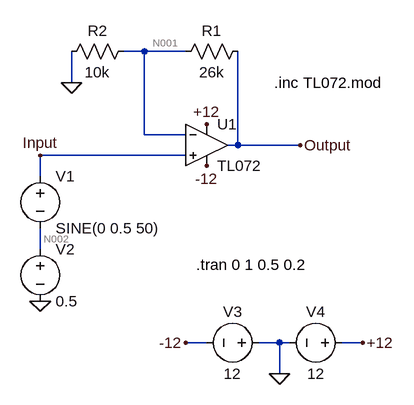
[diagram p0: schematic Noninverting Opamp.asc]
Noninverting Opamp.asc, the LTspice schematic file:
Version 4
SHEET 1 880 680
WIRE 256 0 224 0
WIRE 320 0 256 0
WIRE 144 48 144 0
WIRE 256 128 256 0
WIRE 320 128 256 128
WIRE 400 144 400 0
WIRE 400 144 384 144
WIRE 496 144 400 144
WIRE 320 160 96 160
WIRE 96 192 96 160
WIRE 96 304 96 272
WIRE 352 448 320 448
WIRE 464 448 432 448
WIRE 480 448 464 448
WIRE 592 448 560 448
WIRE 464 496 464 448
FLAG 96 384 0
FLAG 144 48 0
FLAG 496 144 Output
FLAG 96 160 Input
FLAG 464 496 0
FLAG 320 448 -12
FLAG 592 448 +12
FLAG 352 176 -12
FLAG 352 112 +12
SYMBOL voltage 96 176 R0
WINDOW 123 0 0 Left 0
WINDOW 39 0 0 Left 0
SYMATTR InstName V1
SYMATTR Value SINE(0 0.5 50)
SYMBOL Opamps\\opamp2 352 80 R0
SYMATTR InstName U1
SYMATTR Value TL072
SYMBOL voltage 96 288 R0
WINDOW 123 0 0 Left 0
WINDOW 39 0 0 Left 0
SYMATTR InstName V2
SYMATTR Value 0.5
SYMBOL res 240 -16 R90
WINDOW 0 0 56 VBottom 2
WINDOW 3 32 56 VTop 2
SYMATTR InstName R2
SYMATTR Value 10k
SYMBOL res 416 -16 R90
WINDOW 0 0 56 VBottom 2
WINDOW 3 32 56 VTop 2
SYMATTR InstName R1
SYMATTR Value 26k
SYMBOL voltage 448 448 R90
WINDOW 0 -32 56 VBottom 2
WINDOW 3 32 56 VTop 2
WINDOW 123 0 0 Left 0
WINDOW 39 0 0 Left 0
SYMATTR InstName V3
SYMATTR Value 12
SYMBOL voltage 576 448 R90
WINDOW 0 -32 56 VBottom 2
WINDOW 3 32 56 VTop 2
WINDOW 123 0 0 Left 0
WINDOW 39 0 0 Left 0
SYMATTR InstName V4
SYMATTR Value 12
TEXT 336 328 Left 2 !.tran 0 1 0.5 0.2
TEXT 456 48 Left 2 !.inc TL072.mod

The netlist it stands for:
* Noninverting Opamp.asc
V1 Input N002 SINE(0 0.5 50)
XU1 Input N001 +12 -12 Output TL072  ; pins In+ In- V+ V- OUT
V2 N002 0 0.5
R2 N001 0 10k
R1 Output N001 26k
V3 0 -12 12
V4 +12 0 12
.tran 0 1 0.5 0.2
.inc TL072.mod
.backanno
.end

* Results of the author's LTspice run, read from the files saved beside the schematic
* Operating Point, zero values left out:
*   V(input) = 500 mV
*   V(n002) = 500 mV
*   V(output) = 1.8 V
*   V(-12) = -12 V
*   V(+12) = 12 V
*   V(n001) = 500 mV
*   I(R1) = 50 µA
*   I(R2) = 50 µA
*   I(V4) = -11.39 mA
*   I(V3) = -11.39 mA
*   I(V2) = -42.55 pA
*   I(V1) = -42.55 pA
*   Ix(u1:1) = 42.55 pA
*   Ix(u1:2) = 42.55 pA
*   Ix(u1:3) = 11.39 mA
*   Ix(u1:4) = -11.39 mA
*   Ix(u1:5) = -50 µA
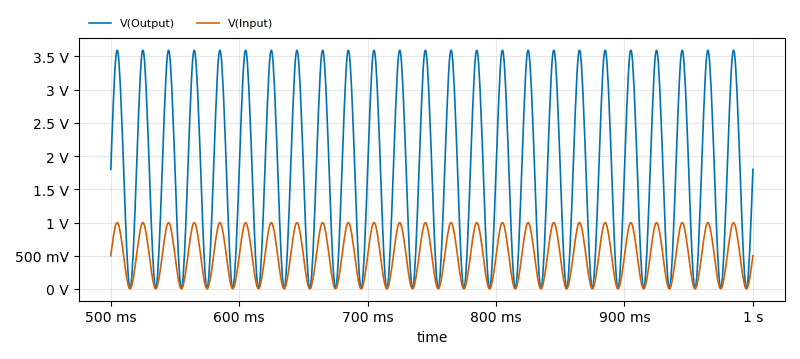
[diagram p1: Transient Analysis of Noninverting Opamp.asc, plotted from the saved traces]
* Transient Analysis, 1 run:
*   V(Output): min 10.32 mV, max 3.589 V, average 1.796 V, rms 2.194 V, last 1.8 V
*   V(Input): min 2.853 mV, max 997.1 mV, average 499 mV, rms 609.6 mV, last 500 mV